# EAGLE schematic PCBDesign_v6 (EAGLE 9.7.0)
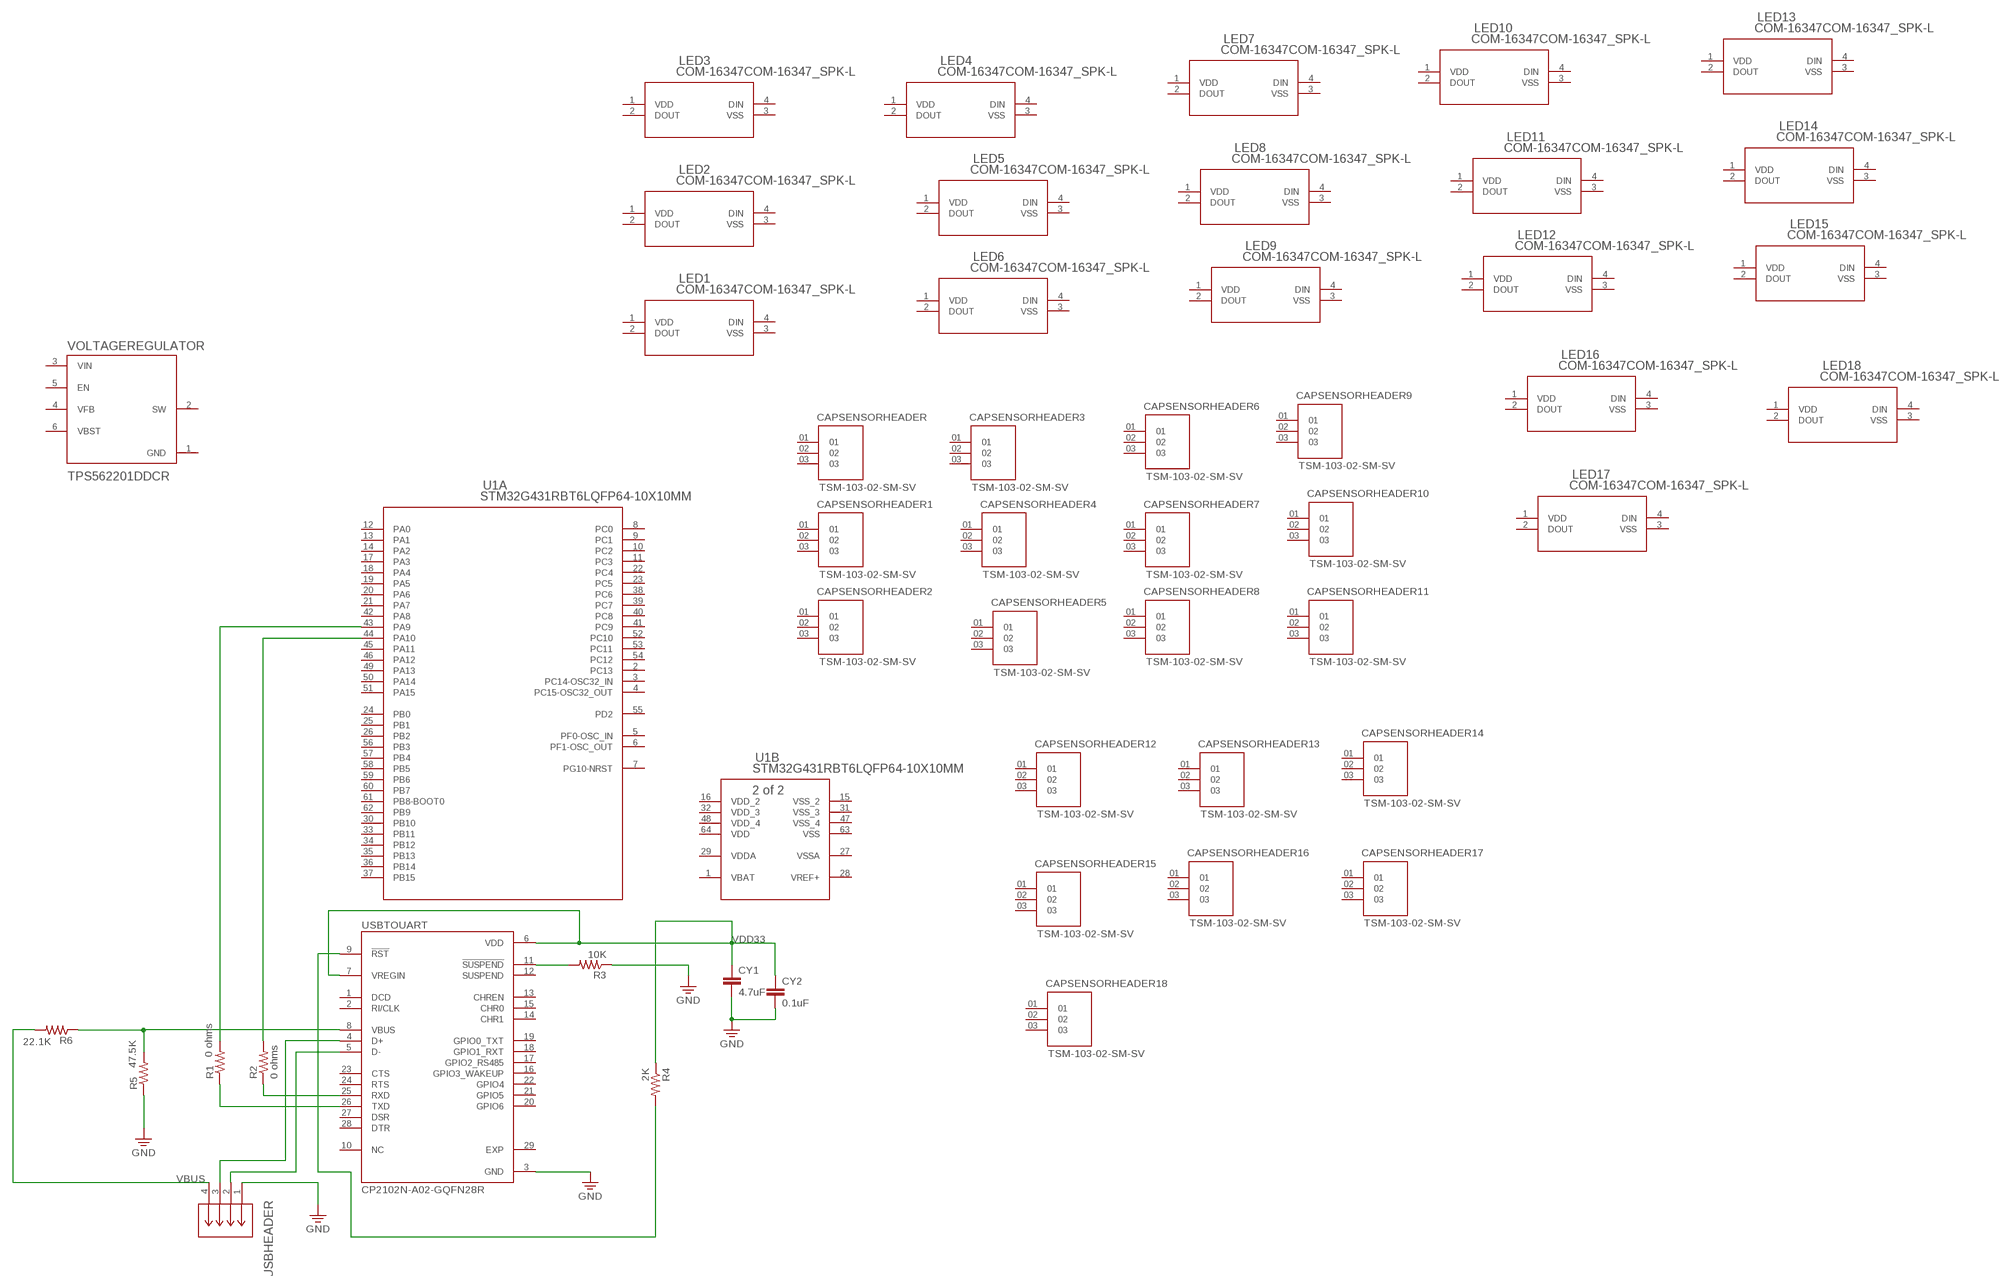
[diagram p0: schematic, sheet 1]

## Parts
CAPSENSORHEADER  TSM-103-02-SM-SV  [SAMTEC_TSM-103-02-SM-SV]
CAPSENSORHEADER1  TSM-103-02-SM-SV  [SAMTEC_TSM-103-02-SM-SV]
CAPSENSORHEADER2  TSM-103-02-SM-SV  [SAMTEC_TSM-103-02-SM-SV]
CAPSENSORHEADER3  TSM-103-02-SM-SV  [SAMTEC_TSM-103-02-SM-SV]
CAPSENSORHEADER4  TSM-103-02-SM-SV  [SAMTEC_TSM-103-02-SM-SV]
CAPSENSORHEADER5  TSM-103-02-SM-SV  [SAMTEC_TSM-103-02-SM-SV]
CAPSENSORHEADER6  TSM-103-02-SM-SV  [SAMTEC_TSM-103-02-SM-SV]
CAPSENSORHEADER7  TSM-103-02-SM-SV  [SAMTEC_TSM-103-02-SM-SV]
CAPSENSORHEADER8  TSM-103-02-SM-SV  [SAMTEC_TSM-103-02-SM-SV]
CAPSENSORHEADER9  TSM-103-02-SM-SV  [SAMTEC_TSM-103-02-SM-SV]
CAPSENSORHEADER10  TSM-103-02-SM-SV  [SAMTEC_TSM-103-02-SM-SV]
CAPSENSORHEADER11  TSM-103-02-SM-SV  [SAMTEC_TSM-103-02-SM-SV]
CAPSENSORHEADER12  TSM-103-02-SM-SV  [SAMTEC_TSM-103-02-SM-SV]
CAPSENSORHEADER13  TSM-103-02-SM-SV  [SAMTEC_TSM-103-02-SM-SV]
CAPSENSORHEADER14  TSM-103-02-SM-SV  [SAMTEC_TSM-103-02-SM-SV]
CAPSENSORHEADER15  TSM-103-02-SM-SV  [SAMTEC_TSM-103-02-SM-SV]
CAPSENSORHEADER16  TSM-103-02-SM-SV  [SAMTEC_TSM-103-02-SM-SV]
CAPSENSORHEADER17  TSM-103-02-SM-SV  [SAMTEC_TSM-103-02-SM-SV]
CAPSENSORHEADER18  TSM-103-02-SM-SV  [SAMTEC_TSM-103-02-SM-SV]
CY1  4.7uF  CYYC7B5  [YC7B5]
CY2  0.1uF  CYYC7B5  [YC7B5]
LED1  COM-16347COM-16347_SPK-L  [COM-16347_SPK-L]
LED2  COM-16347COM-16347_SPK-L  [COM-16347_SPK-L]
LED3  COM-16347COM-16347_SPK-L  [COM-16347_SPK-L]
LED4  COM-16347COM-16347_SPK-L  [COM-16347_SPK-L]
LED5  COM-16347COM-16347_SPK-L  [COM-16347_SPK-L]
LED6  COM-16347COM-16347_SPK-L  [COM-16347_SPK-L]
LED7  COM-16347COM-16347_SPK-L  [COM-16347_SPK-L]
LED8  COM-16347COM-16347_SPK-L  [COM-16347_SPK-L]
LED9  COM-16347COM-16347_SPK-L  [COM-16347_SPK-L]
LED10  COM-16347COM-16347_SPK-L  [COM-16347_SPK-L]
LED11  COM-16347COM-16347_SPK-L  [COM-16347_SPK-L]
LED12  COM-16347COM-16347_SPK-L  [COM-16347_SPK-L]
LED13  COM-16347COM-16347_SPK-L  [COM-16347_SPK-L]
LED14  COM-16347COM-16347_SPK-L  [COM-16347_SPK-L]
LED15  COM-16347COM-16347_SPK-L  [COM-16347_SPK-L]
LED16  COM-16347COM-16347_SPK-L  [COM-16347_SPK-L]
LED17  COM-16347COM-16347_SPK-L  [COM-16347_SPK-L]
LED18  COM-16347COM-16347_SPK-L  [COM-16347_SPK-L]
R1  0 ohms  R-US_01005  [R01005]
R2  0 ohms  R-US_01005  [R01005]
R3  10K  R-US_01005  [R01005]
R4  2K  R-US_01005  [R01005]
R5  47.5K  R-US_01005  [R01005]
R6  22.1K  R-US_01005  [R01005]
U1  STM32G431RBT6LQFP64-10X10MM  [LQFP64-10X10MM]
USBHEADER  USB-AP-S-RA-SMTCONN_USB-AP-S-RA-SMT_ADM  [CONN_USB-AP-S-RA-SMT_ADM]
USBTOUART  CP2102N-A02-GQFN28R  [IC_CP2102N-A02-GQFN28R]
VOLTAGEREGULATOR  TPS562201DDCR  [SOT95P280X110-6N]

## Nets
GND: CY1.2 CY2.2 R3.1 R5.1 USBHEADER.1 USBTOUART.3(GND)
N$1: R2.1 USBTOUART.25(RXD)
N$2: R2.2 U1.44(A:PA10)
N$3: R1.2 U1.43(A:PA9)
N$4: R1.1 USBTOUART.26(TXD)
N$5: R3.2 USBTOUART.11(!SUSPEND)
N$6: USBHEADER.3 USBTOUART.4(D+)
N$7: USBHEADER.2 USBTOUART.5(D-)
N$8: R4.2 USBTOUART.9(!RST)
N$9: R5.2 R6.1 USBTOUART.8(VBUS)
VBUS: R6.2 USBHEADER.4
VDD33: CY1.1 CY2.1 R4.1 USBTOUART.6(VDD) USBTOUART.7(VREGIN)
Unconnected: CAPSENSORHEADER1.01 CAPSENSORHEADER1.02 CAPSENSORHEADER1.03 CAPSENSORHEADER2.01 CAPSENSORHEADER2.02 CAPSENSORHEADER2.03 CAPSENSORHEADER3.01 CAPSENSORHEADER3.02 CAPSENSORHEADER3.03 CAPSENSORHEADER4.01 CAPSENSORHEADER4.02 CAPSENSORHEADER4.03 CAPSENSORHEADER5.01 CAPSENSORHEADER5.02 CAPSENSORHEADER5.03 CAPSENSORHEADER6.01 CAPSENSORHEADER6.02 CAPSENSORHEADER6.03 CAPSENSORHEADER7.01 CAPSENSORHEADER7.02 CAPSENSORHEADER7.03 CAPSENSORHEADER8.01 CAPSENSORHEADER8.02 CAPSENSORHEADER8.03 CAPSENSORHEADER9.01 CAPSENSORHEADER9.02 CAPSENSORHEADER9.03 CAPSENSORHEADER10.01 CAPSENSORHEADER10.02 CAPSENSORHEADER10.03 CAPSENSORHEADER11.01 CAPSENSORHEADER11.02 CAPSENSORHEADER11.03 CAPSENSORHEADER12.01 CAPSENSORHEADER12.02 CAPSENSORHEADER12.03 CAPSENSORHEADER13.01 CAPSENSORHEADER13.02 CAPSENSORHEADER13.03 CAPSENSORHEADER14.01 CAPSENSORHEADER14.02 CAPSENSORHEADER14.03 CAPSENSORHEADER15.01 CAPSENSORHEADER15.02 CAPSENSORHEADER15.03 CAPSENSORHEADER16.01 CAPSENSORHEADER16.02 CAPSENSORHEADER16.03 CAPSENSORHEADER17.01 CAPSENSORHEADER17.02 CAPSENSORHEADER17.03 CAPSENSORHEADER18.01 CAPSENSORHEADER18.02 CAPSENSORHEADER18.03 CAPSENSORHEADER.01 CAPSENSORHEADER.02 CAPSENSORHEADER.03 LED1.2(DOUT) LED1.3(VSS) LED1.4(DIN) LED2.2(DOUT) LED2.3(VSS) LED2.4(DIN) LED3.2(DOUT) LED3.3(VSS) LED3.4(DIN) LED4.2(DOUT) LED4.3(VSS) LED4.4(DIN) LED5.2(DOUT) LED5.3(VSS) LED5.4(DIN) LED6.2(DOUT) LED6.3(VSS) LED6.4(DIN) LED7.2(DOUT) LED7.3(VSS) LED7.4(DIN) LED8.2(DOUT) LED8.3(VSS) LED8.4(DIN) LED9.2(DOUT) LED9.3(VSS) LED9.4(DIN) LED10.2(DOUT) LED10.3(VSS) LED10.4(DIN) LED11.2(DOUT) LED11.3(VSS) LED11.4(DIN) LED12.2(DOUT) LED12.3(VSS) LED12.4(DIN) LED13.2(DOUT) LED13.3(VSS) LED13.4(DIN) LED14.2(DOUT) LED14.3(VSS) LED14.4(DIN) LED15.2(DOUT) LED15.3(VSS) LED15.4(DIN) LED16.2(DOUT) LED16.3(VSS) LED16.4(DIN) LED17.2(DOUT) LED17.3(VSS) LED17.4(DIN) LED18.2(DOUT) LED18.3(VSS) LED18.4(DIN) U1.2(A:PC13) U1.3(A:PC14-OSC32_IN) U1.4(A:PC15-OSC32_OUT) U1.5(A:PF0-OSC_IN) U1.6(A:PF1-OSC_OUT) U1.7(A:PG10-NRST) U1.8(A:PC0) U1.9(A:PC1) U1.10(A:PC2) U1.11(A:PC3) U1.12(A:PA0) U1.13(A:PA1) U1.14(A:PA2) U1.17(A:PA3) U1.18(A:PA4) U1.19(A:PA5) U1.20(A:PA6) U1.21(A:PA7) U1.22(A:PC4) U1.23(A:PC5) U1.24(A:PB0) U1.25(A:PB1) U1.26(A:PB2) U1.30(A:PB10) U1.33(A:PB11) U1.34(A:PB12) U1.35(A:PB13) U1.36(A:PB14) U1.37(A:PB15) U1.38(A:PC6) U1.39(A:PC7) U1.40(A:PC8) U1.41(A:PC9) U1.42(A:PA8) U1.45(A:PA11) U1.46(A:PA12) U1.49(A:PA13) U1.50(A:PA14) U1.51(A:PA15) U1.52(A:PC10) U1.53(A:PC11) U1.54(A:PC12) U1.55(A:PD2) U1.56(A:PB3) U1.57(A:PB4) U1.58(A:PB5) U1.59(A:PB6) U1.60(A:PB7) U1.61(A:PB8-BOOT0) U1.62(A:PB9) USBTOUART.1(DCD) USBTOUART.2(RI/CLK) USBTOUART.10(NC) USBTOUART.12(SUSPEND) USBTOUART.13(CHREN) USBTOUART.14(CHR1) USBTOUART.15(CHR0) USBTOUART.16(GPIO3_WAKEUP) USBTOUART.17(GPIO2_RS485) USBTOUART.18(GPIO1_RXT) USBTOUART.19(GPIO0_TXT) USBTOUART.20(GPIO6) USBTOUART.21(GPIO5) USBTOUART.22(GPIO4) USBTOUART.23(CTS) USBTOUART.24(RTS) USBTOUART.27(DSR) USBTOUART.28(DTR) VOLTAGEREGULATOR.2(SW) VOLTAGEREGULATOR.4(VFB) VOLTAGEREGULATOR.5(EN) VOLTAGEREGULATOR.6(VBST)

## Power pins joined to a net without a drawn wire
EXP: USBTOUART.29(EXP)
GND: VOLTAGEREGULATOR.1(GND)
VBAT: U1.1(B:VBAT)
VDD: LED1.1(VDD) LED2.1(VDD) LED3.1(VDD) LED4.1(VDD) LED5.1(VDD) LED6.1(VDD) LED7.1(VDD) LED8.1(VDD) LED9.1(VDD) LED10.1(VDD) LED11.1(VDD) LED12.1(VDD) LED13.1(VDD) LED14.1(VDD) LED15.1(VDD) LED16.1(VDD) LED17.1(VDD) LED18.1(VDD) U1.64(B:VDD)
VDD_2: U1.16(B:VDD_2)
VDD_3: U1.32(B:VDD_3)
VDD_4: U1.48(B:VDD_4)
VDDA: U1.29(B:VDDA)
VIN: VOLTAGEREGULATOR.3(VIN)
VREF+: U1.28(B:VREF+)
VSS: U1.63(B:VSS)
VSS_2: U1.15(B:VSS_2)
VSS_3: U1.31(B:VSS_3)
VSS_4: U1.47(B:VSS_4)
VSSA: U1.27(B:VSSA)

## Library data of the parts
CAPSENSORHEADER CAPSENSORHEADER1-CAPSENSORHEADER18 = Pinheaders-TSM-103-02-SM-SV:TSM-103-02-SM-SV; MANUFACTURER: SAMTEC
CY1 CY2 = rcl:CY: Y CAPACITOR for power line; SPICEPREFIX: C
LED1-LED18 = LED-COM_16347:COM-16347; COPYRIGHT: Copyright (C) 2024 Ultra Librarian. All rights reserved.; MANUFACTURER_PART_NUMBER: COM-16347; MFR_NAME: Sparkfun; TYPE: LED Addressable
R1-R6 = rcl:R-US_: RESISTOR, American symbol; SPICEPREFIX: R
U1 = Microcontroller-STM32G431RBT6:STM32G431RBT6; COPYRIGHT: Copyright (C) 2024 Ultra Librarian. All rights reserved.; MANUFACTURER_PART_NUMBER: STM32G431RBT6; MFR_NAME: STMicroelectronics
USBHEADER = USBheader:USB-AP-S-RA-SMT; COPYRIGHT: Copyright (C) 2024 Ultra Librarian. All rights reserved.; MANUFACTURER_PART_NUMBER: USB-AP-S-RA-SMT; MFR_NAME: ADAM TECHNOLOGIES INC
USBTOUART = usbtouart-CP2102N-A02-GQFN28R:CP2102N-A02-GQFN28R; MANUFACTURER: Silicon Labs; MAXIMUM_PACKAGE_HEIGHT: 0.8 mm; PARTREV: 1.5; SNAPEDA_PN: CP2102N-A02-GQFN28R; STANDARD: Manufacturer Recommendations
VOLTAGEREGULATOR = voltageregulator-TPS562201DDCR:TPS562201DDCR: 4.5 V to 17 V input, 2 A output, synchronous step-down converter in Eco-mode 6-SOT-23-THIN -40 to 125; MANUFACTURER: Texas Instruments; MAXIMUM_PACKAGE_HEIGHT: 1.10 mm; PARTREV: A; STANDARD: IPC-7351B